# EasyEDA schematic LM471.json
TITLE: Sheet_1; REV: 1.0; Date: 2024-01-02; Sheet: 1/1; Company: Your Company
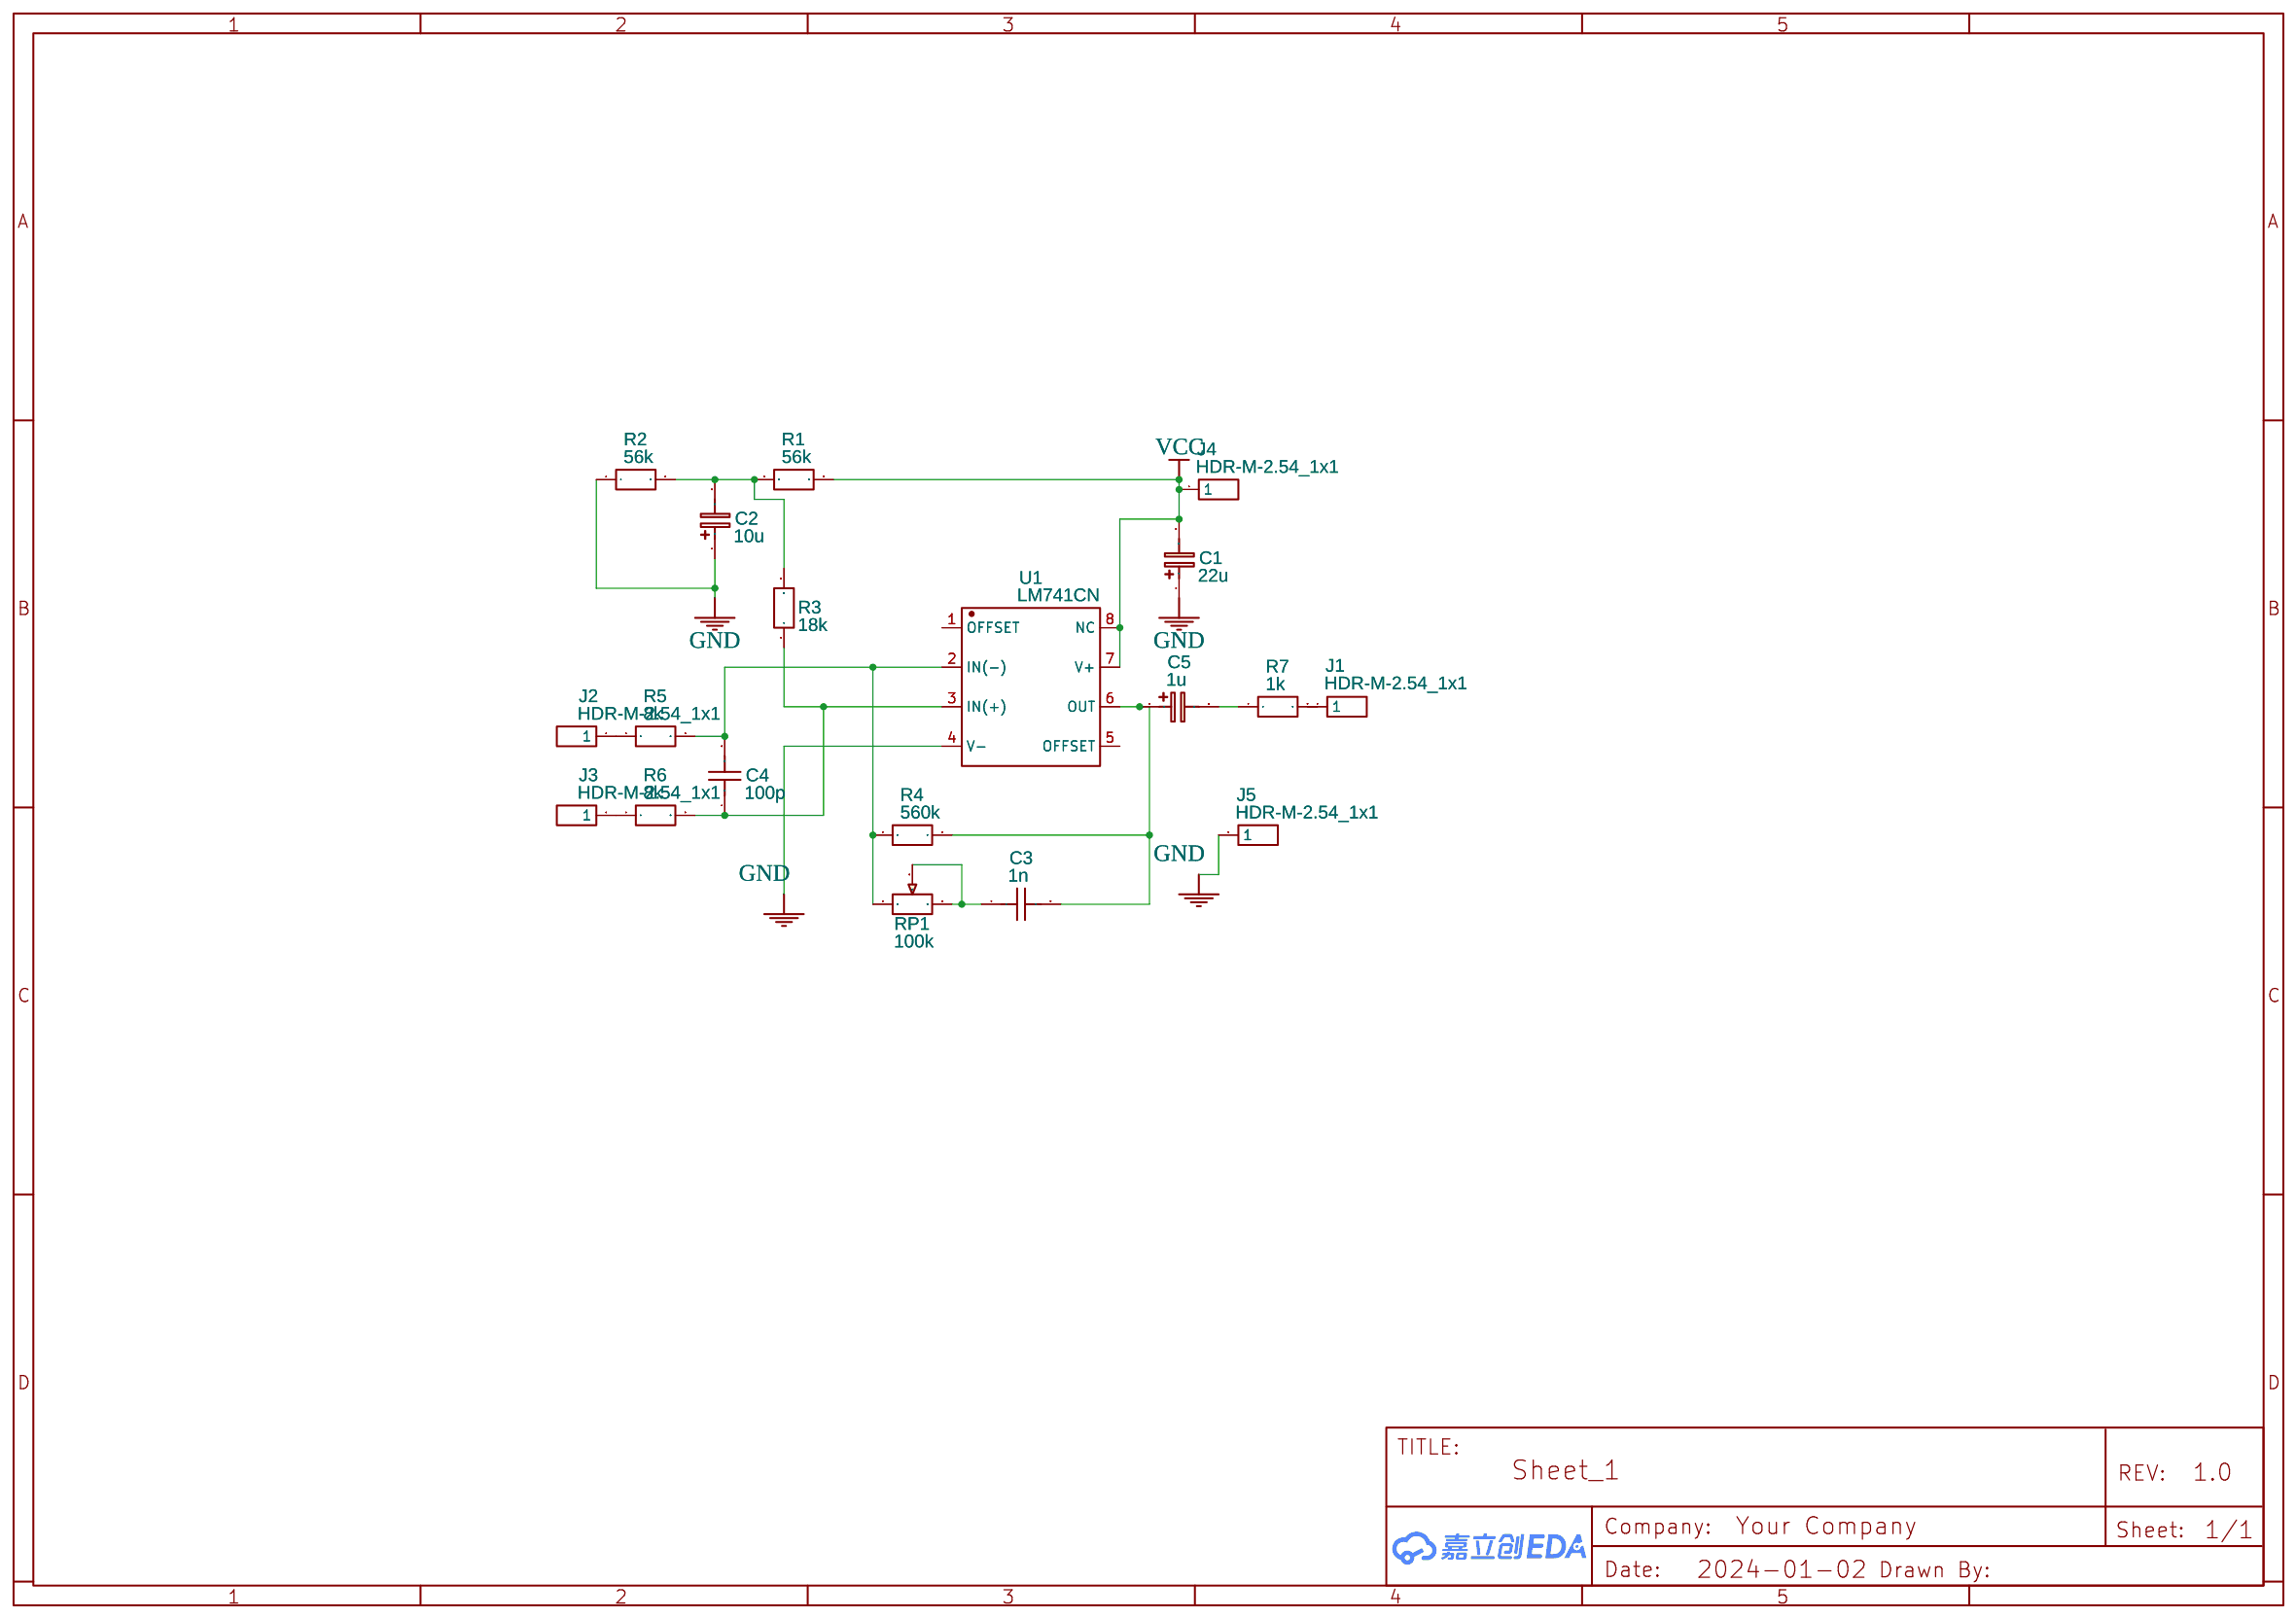
[diagram p0: schematic sheet]

## Parts
C1  22u  [CASE-A_3216]
C2  10u  [CASE-A_3216]
C3  1n  [C0603]
C4  100p  [C0603]
C5  1u  [CASE-A_3216]
J1  HDR-M-2.54_1x1  [HDR-M-2.54_1X1]
J2  HDR-M-2.54_1x1  [HDR-M-2.54_1X1]
J3  HDR-M-2.54_1x1  [HDR-M-2.54_1X1]
J4  HDR-M-2.54_1x1  [HDR-M-2.54_1X1]
J5  HDR-M-2.54_1x1  [HDR-M-2.54_1X1]
R1  56k  [R0603]
R2  56k  [R0603]
R3  18k  [R0603]
R4  560k  [R0603]
R5  8k  [R0603]
R6  8k  [R0603]
R7  1k  [R0603]
RP1  100k  [RES-ADJ-TH_3296W]
U1  LM741CN  [DIP-8_L9.8-W6.6-P2.54-LS7.6-BL]

## Library data of the parts
C1 C2 C5 = C_Tan_SMD_A_EU: Contributor: LCEDA_Lib
C3 C4 = C_0603_US: Contributor: LCEDA_Lib
J1-J5 = HDR-M-2.54_1x1: Supplier Part: C81276; Supplier: LCSC; Contributor: LCEDA_Lib
R1-R7 = R_0603_EU: Contributor: LCEDA_Lib
RP1 = R_3296W_EU: Supplier: LCSC; Contributor: LCEDA_Lib; Value(Ω): 10k
U1 = LM741CN: sourceId: DPJ1jBuM4; Supplier: LCSC; Manufacturer: TI(德州仪器); Supplier Part: C13974; JLCPCB Part Class: Extended Part

## Nets
GND: C1.1 C2.1 J5.1 R2.1 U1.4(V-)
VCC: C1.2 J4.1 R1.2 U1.7(V+) U1.8(NC)
Net-(C2-2): C2.2 R1.1 R2.2 R3.2
Net-(C3-1): C3.1 RP1.2 RP1.3
Net-(C3-2): C3.2 C5.1 R4.2 U1.6(OUT)
Net-(C4-1): C4.1 R3.1 R6.2 U1.3(IN(+))
Net-(C4-2): C4.2 R4.1 R5.2 RP1.1 U1.2(IN(-))
Net-(C5-2): C5.2 R7.1
Net-(J2-1): J2.1 R5.1
Net-(J3-1): J3.1 R6.1

Not connected (* = marked no-connect by the designer): J1 1; R7 2; U1 1(OFFSET) 5(OFFSET)
